# EAGLE design rev1.0.1 (EAGLE 7.2.0)
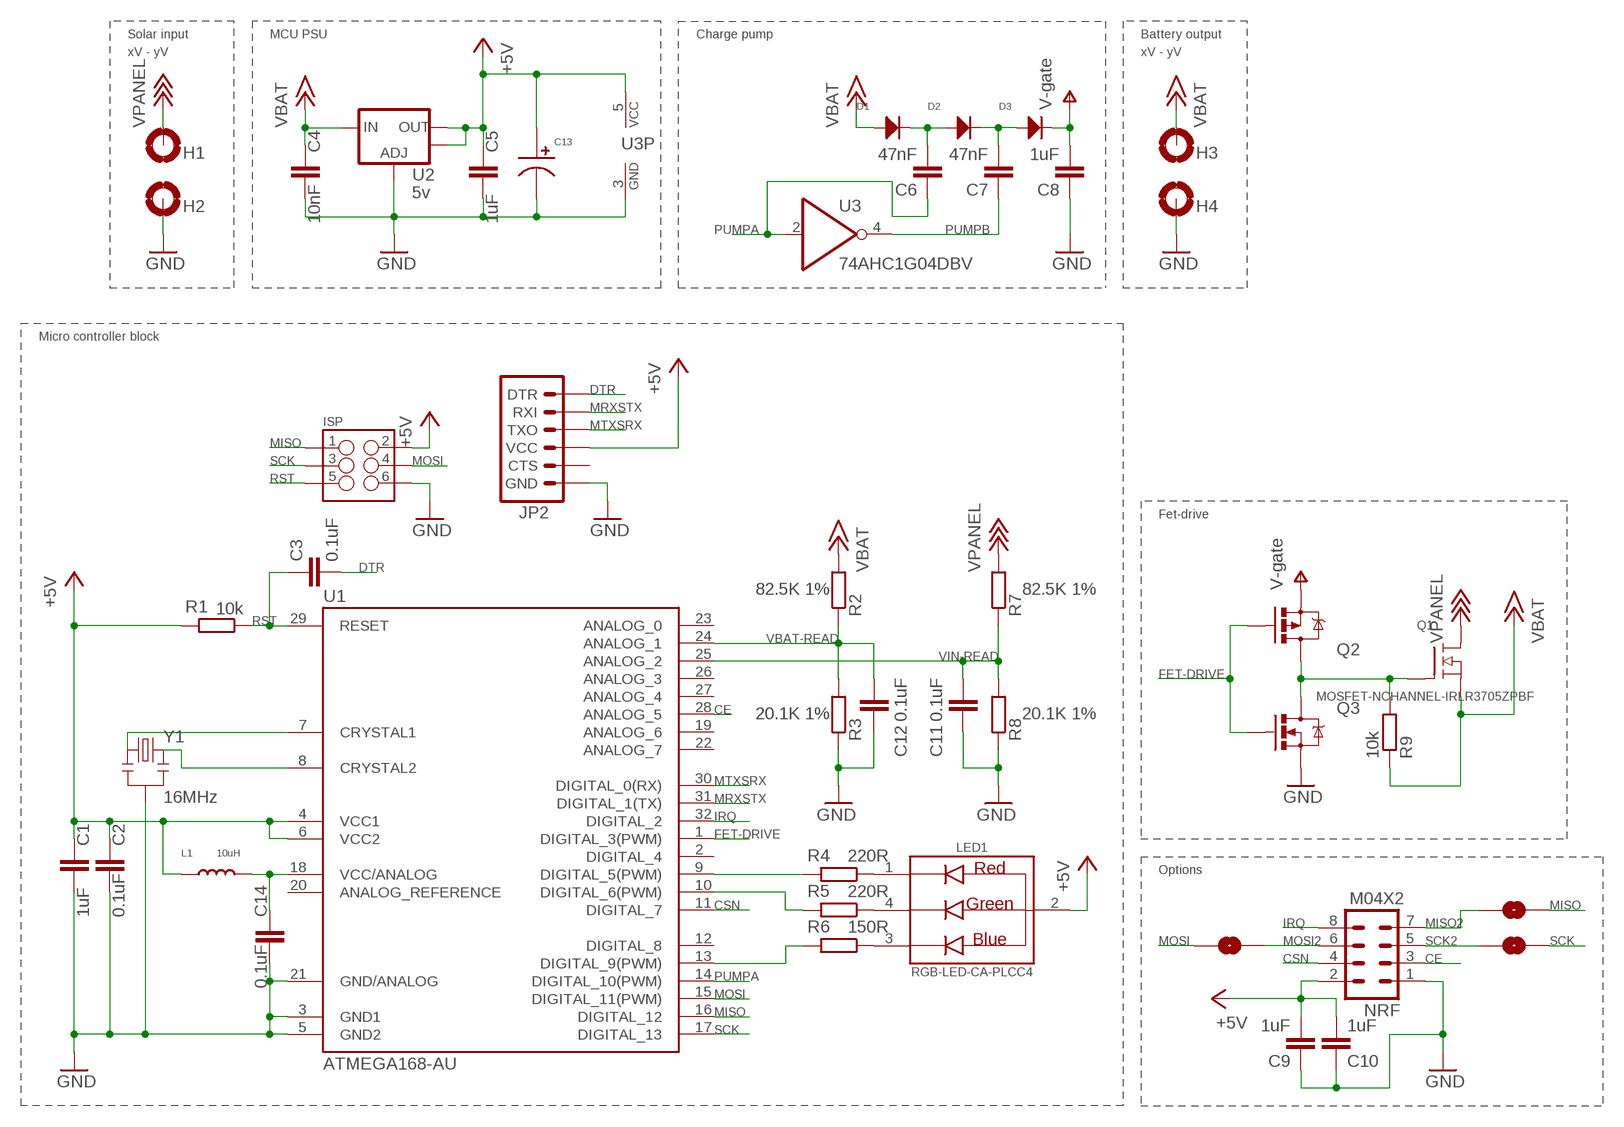
[diagram p0: schematic, sheet 1]

## Parts
C1  1uF  C-EUC0603K  [C0603K]
C2  0.1uF  C-EUC0603K  [C0603K]
C3  0.1uF  C-EUC0603K  [C0603K]
C4  10nF  C-EUC0603K  [C0603K]
C5  1uF  C-EUC0603K  [C0603K]
C6  47nF  C-EUC0603K  [C0603K]
C7  47nF  C-EUC0603K  [C0603K]
C8  1uF  C-EUC0603K  [C0603K]
C9  1uF  C-EUC0603K  [C0603K]
C10  1uF  C-EUC0603K  [C0603K]
C11  0.1uF  C-EUC0603K  [C0603K]
C12  0.1uF  C-EUC0603K  [C0603K]
C13  CAPACITOR_P_4MM  [CP4MM]
C14  0.1uF  C-EUC0603K  [C0603K]
D1  DIODE_SOD-123  [SOD-123]
D2  DIODE_SOD-123  [SOD-123]
D3  DIODE_SOD-123  [SOD-123]
H1  MOUNT-PAD-ROUND3.0  [3,0-PAD]
H2  MOUNT-PAD-ROUND3.0  [3,0-PAD]
H3  MOUNT-PAD-ROUND3.0  [3,0-PAD]
H4  MOUNT-PAD-ROUND3.0  [3,0-PAD]
ISP  M03X22X3_SILK_SM  [2X3]
JP2  ARDUINO_SERIAL_PROGRAMLOCK  [1X06_LOCK]
L1  10uH  INDUCTOR_1210  [L1210]
LED1  RGB-LED-CA-PLCC4  [PLCC4]
NRF  M04X2  [2X4]
Q1  MOSFET-NCHANNEL-IRLR3705ZPBF  [DPAK]
Q2  MOSFET-PCHANNEL  [SOT23]
Q3  MOSFET-NCHANNELBSS138  [SOT23]
R1  10k  R-EU_R0603  [R0603]
R2  82.5K 1%  R-EU_R0603  [R0603]
R3  20.1K 1%  R-EU_R0603  [R0603]
R4  220R  R-EU_R0603  [R0603]
R5  220R  R-EU_R0603  [R0603]
R6  150R  R-EU_R0603  [R0603]
R7  82.5K 1%  R-EU_R0603  [R0603]
R8  20.1K 1%  R-EU_R0603  [R0603]
R9  10k  R-EU_R0603  [R0603]
SJ2  SOLDERJUMPERNO  [SJ_2S-NO]
SJ5  SOLDERJUMPERNO  [SJ_2S-NO]
SJ6  SOLDERJUMPERNO  [SJ_2S-NO]
U1  ATMEGA168-AU  [TQFP32-08]
U2  5v  V_REG_LM1117SOT223  [SOT223]
U3  74AHC1G04DBV  [SOT23-5]
Y1  16MHz  RESONATOR16MHZ  [RESONATOR-SMD]

## Nets
+5V: C1.1 C2.1 C5.1 C9.2 C10.2 C13.P$1 ISP.2 JP2.4(VCC) L1.P$1 LED1.2(CA) NRF.2 R1.2 U1.4(VCC1) U1.6(VCC2) U2.2(OUT) U2.4(OUT) U3.5(VCC)
+15V: C4.1 D1.ANODE H3.B3,0(MOUNT) Q1.2(S) R2.2 R9.1 U2.3(IN) ; supply symbol labelled VBAT
+18V: H1.B3,0(MOUNT) Q1.TAB(D) R7.2 ; supply symbol labelled VPANEL
CE: NRF.3 U1.28(ANALOG_5)
CSN: NRF.4 U1.11(DIGITAL_7)
DTR: C3.2 JP2.1(DTR)
FET-DRIVE: Q2.1(G) Q3.1(G) U1.1(DIGITAL_3(PWM))
FET-PUMP: Q1.1(G) Q2.3(D) Q3.3(D) R9.2
GND: C1.2 C2.2 C4.2 C5.2 C8.1 C9.1 C10.1 C11.1 C12.1 C13.P$2 C14.2 H2.B3,0(MOUNT) H4.B3,0(MOUNT) ISP.6 JP2.6(GND) NRF.1 Q3.2(S) R3.1 R8.1 U1.3(GND1) U1.5(GND2) U1.21(GND/ANALOG) U2.1(ADJ) U3.3(GND) Y1.2
IRQ: NRF.8 U1.32(DIGITAL_2)
MISO: ISP.1 SJ6.2 U1.16(DIGITAL_12)
MISO2: NRF.7 SJ6.1
MOSI: ISP.4 SJ2.1 U1.15(DIGITAL_11(PWM))
MOSI2: NRF.6 SJ2.2
MRXSTX: JP2.2(RXI) U1.31(DIGITAL_1(TX))
MTXSRX: JP2.3(TXO) U1.30(DIGITAL_0(RX))
N$1: U1.8(CRYSTAL2) Y1.3
N$2: U1.7(CRYSTAL1) Y1.1
N$3: R4.2 U1.9(DIGITAL_5(PWM))
N$4: LED1.4(GC) R5.1
N$5: LED1.1(RC) R4.1
N$6: LED1.3(BC) R6.1
N$7: R5.2 U1.10(DIGITAL_6(PWM))
N$8: C7.2 D2.CATHODE D3.ANODE
N$9: R6.2 U1.13(DIGITAL_9(PWM))
N$10: C6.2 D1.CATHODE D2.ANODE
N$14: C14.1 L1.P$2 U1.18(VCC/ANALOG)
PUMPA: C6.1 U1.14(DIGITAL_10(PWM)) U3.2(I)
PUMPB: C7.1 U3.4(O)
RST: C3.1 ISP.5 R1.1 U1.29(RESET)
SCK: ISP.3 SJ5.2 U1.17(DIGITAL_13)
SCK2: NRF.5 SJ5.1
V+: C8.2 D3.CATHODE Q2.2(S) ; supply symbol labelled V-gate
VBAT-READ: C12.2 R2.1 R3.2 U1.24(ANALOG_1)
VIN-READ: C11.2 R7.1 R8.2 U1.25(ANALOG_2)
Unconnected: JP2.5(CTS) U1.2(DIGITAL_4) U1.12(DIGITAL_8) U1.19(ANALOG_6) U1.20(ANALOG_REFERENCE) U1.22(ANALOG_7) U1.23(ANALOG_0) U1.26(ANALOG_3) U1.27(ANALOG_4)

## Notes on the sheet
- Solar input | MCU PSU | Charge pump | Battery output
- xV - yV | xV - yV
- Micro controller block
- Fet-drive
- Options

## Library data of the parts
C1-C12 C14 = resistor:C-EU: CAPACITOR, European symbol
C13 = MF_Passives:CAPACITOR_P: Library: MF_Passives Description: Device for Polarized Capacitors. Manufacture part number (MFG#), Voltage Rating, and Tolerance can be added via Attributes.; MFG#: N/A; TOLERANCE: N/A; VOLTAGE: N/A
D1-D3 = MF_Discrete_Semiconductor:DIODE: Library: MF_Discrete_Semiconductor Description: Device for Single Packaged Diodes. Manufacture part number (MFG#) can be added via Attributes.; MFG#: N/A
H1-H4 = holes:MOUNT-PAD-ROUND: MOUNTING PAD, round
ISP = SparkFun-Connectors:M03X2: 2x3 .1" header. Shrouded, with keying- CONN-10681 SMT- CONN-11415 Pogo pins- HW-11044
JP2 = SparkFun-Connectors:ARDUINO_SERIAL_PROGRAM: FTDI connector footprints
L1 = MF_Passives:INDUCTOR: Library: MF_Passives Description: Device for Inductors. Manufacture part number (MFG#) can be added via Attributes.; MFG#: N/A
LED1 = Custom-parts:RGB-LED-CA-
NRF = SparkFun-Connectors:M04X2: .1" header, two rows of four.
Q1 = Custom-parts:MOSFET-NCHANNEL-
Q2 = SparkFun-DiscreteSemi:MOSFET-PCHANNEL: Generic PMOSFET
Q3 = SparkFun-DiscreteSemi:MOSFET-NCHANNEL: Common NMOSFET Parts MFG P/N Store ID Prod ID FDD8780 TRANS-09984 SI7820DN TRANS-11055 FDS6630A IC-08089 2N7002PW TRANS-11151 FQP30N06L COM-10213 TRANS-10060 BSS123LT1G TRANS-08345 BSS138 TRANS-00830 BS170 2N7000; PROD_ID: TRANS-00830
R1-R9 = resistor:R-EU_: RESISTOR, European symbol
SJ2 SJ5 SJ6 = SparkFun-Passives:SOLDERJUMPER: Solder Jumper Standard SMD solder jumper. Used to automate production. Two varients : Normally Open and Normally Closed are the same, but have different paste layers. NC will have a large amount of paste and should jumper during reflow.
U1 = Arduino-AVR:ATMEGA168
U2 = SparkFun-PowerIC:V_REG_LM1117: Voltage Regulator LM1117 Standard adjustable voltage regulator but in SMD form. Spark Fun Electronics SKU : COM-00595
U3 = 74xx-little-de:74*1G04: INVERTER Gate
Y1 = SparkFun-FreqCtrl:RESONATOR: Resonator Small SMD resonator. Used, eg, on the Arduino Pro/ Pro Mini boards. 8MHz- XTAL-08895 16MHz- XTAL-08900; PROD_ID: XTAL-08900

## Board
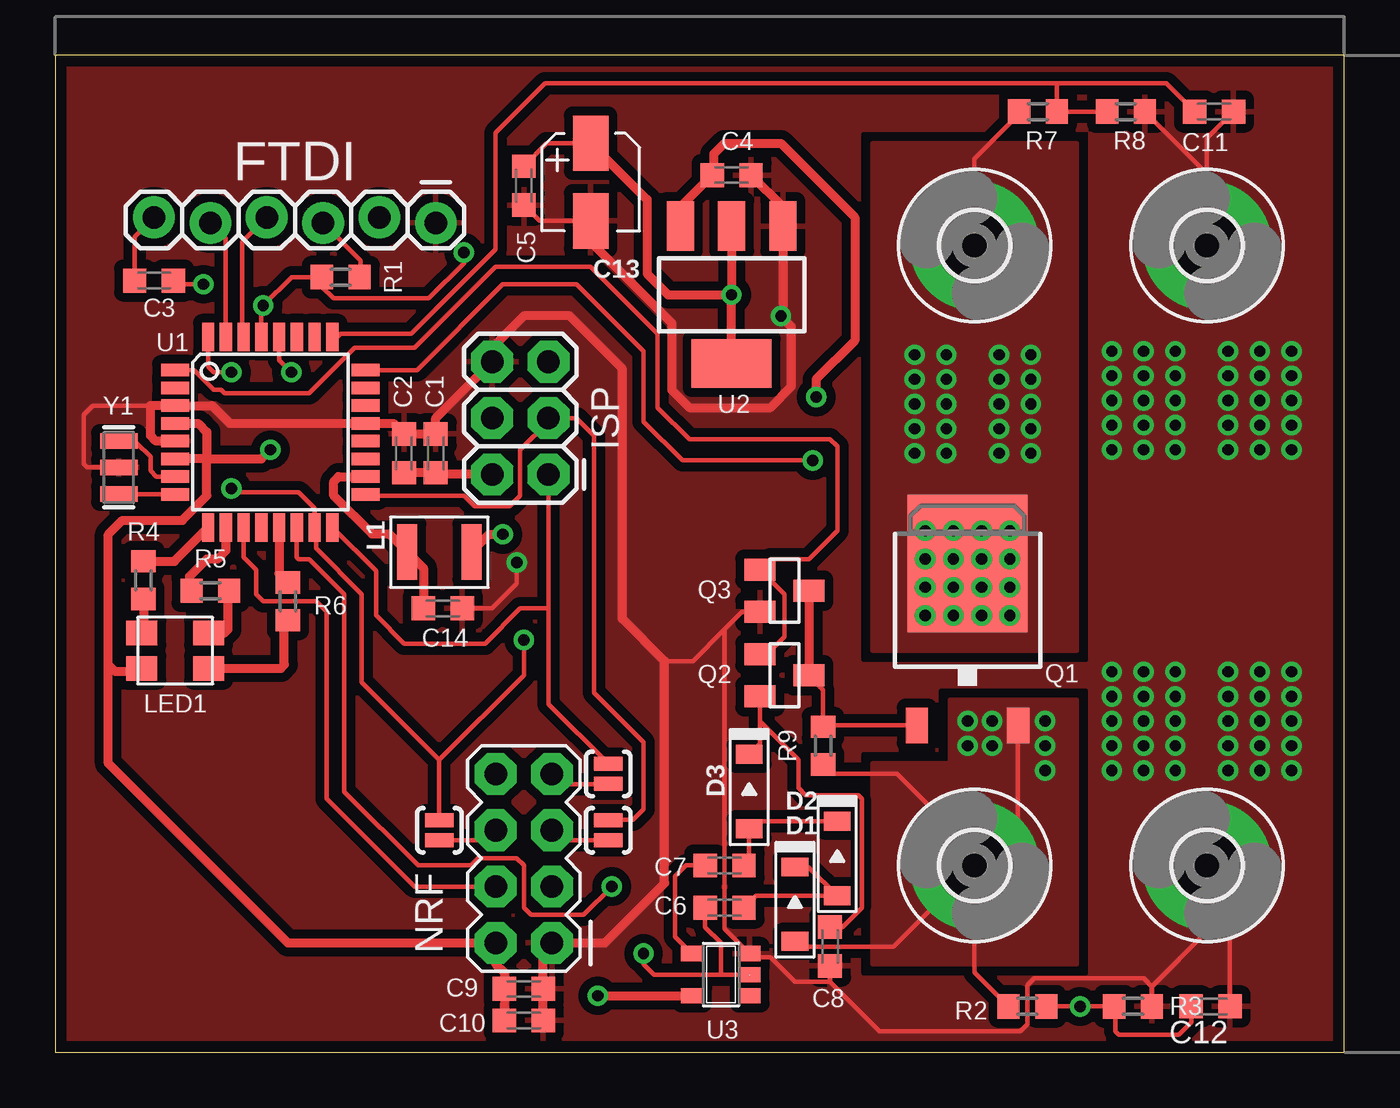
[diagram p1: board, top side]
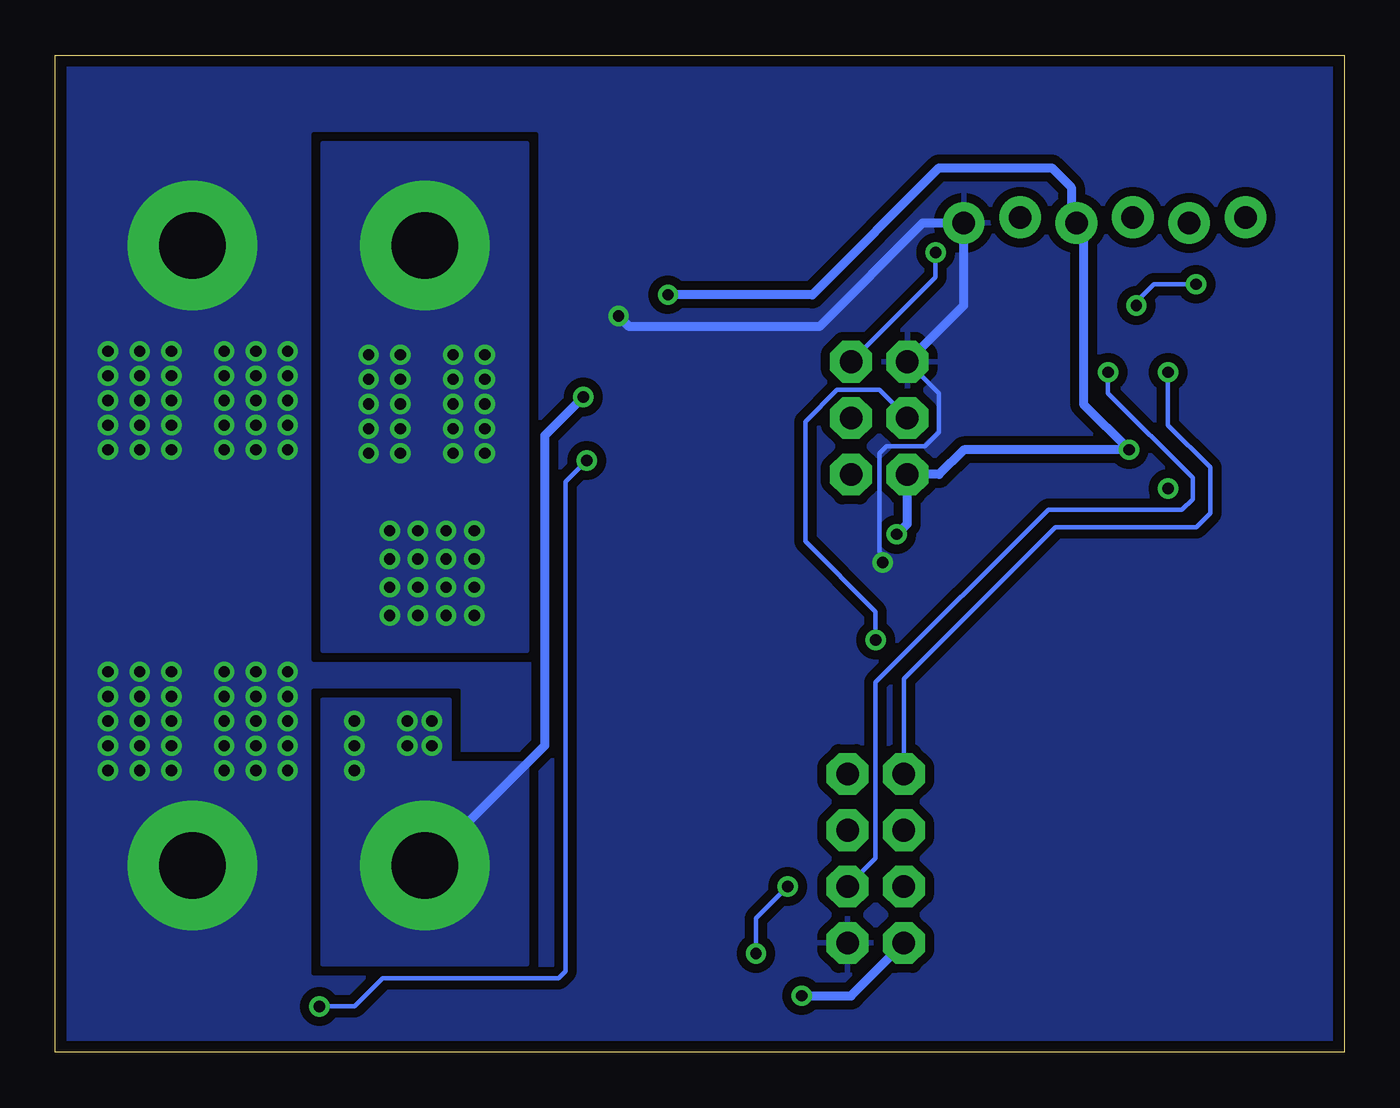
[diagram p2: board, bottom side, seen from below]

Size 58.09 x 44.92 mm. Coordinates in mm from the lower left corner, seen from the top.
Outline: 0,0 58.09,0 58.09,44.92 0,44.92 0,0
Copper layers (1*16): Top 0.035mm / dielectric 1.5mm / Bottom 0.035mm
Design rules "OSH park": minimum track width 6mil, minimum drill 13mil, track to track 6mil, track to pad 6mil, pad to pad 6mil, via to via 6mil, smd to smd 6mil, copper to edge 20mil, drill to drill 16mil, minimum pad ring 10mil, minimum via ring 8mil, stop-mask expansion 4mil, vias tented up to drill 0mil, thermal gap 16mil

### Footprints (pad centres in the part's own frame; a part is rotated, then mirrored left to right if it is on the bottom)
C0603K = smd 1.05 x 1.08: 1 -0.875,0; 2 0.875,0
CP4MM = smd 1.6 x 2.5: P$1 0,-1.75; P$2 0,1.75
SOD-123 = smd 0.85 x 1.2: ANODE 1.675,0; CATHODE -1.675,0
3,0-PAD = drill 3 pad 5.842: B3,0 0,0
2X3 = drill 1.016 pad 1.88 octagon: 1 0,0; 2 0,2.54; 3 2.54,0; 4 2.54,2.54; 5 5.08,0; 6 5.08,2.54
1X06_LOCK = drill 1.016 pad 1.88: 1 0,0; 2 2.54,-0.254; 3 5.08,0; 4 7.62,-0.254; 5 10.16,0; 6 12.7,-0.254
L1210 = smd 0.9 x 2.5: P$1 -1.45,0; P$2 1.45,0
PLCC4 = smd 1.4 x 1.1: 1 -1.5,0.8; 2 -1.5,-0.8; 3 1.5,-0.8; 4 1.5,0.8
2X4 = drill 1.016 pad 1.88 octagon: 1 -3.81,-1.27; 2 -3.81,1.27; 3 -1.27,-1.27; 4 -1.27,1.27; 5 1.27,-1.27; 6 1.27,1.27; 7 3.81,-1.27; 8 3.81,1.27
DPAK = smd 1 x 1.6: 1 -2.28,-6.07; 2 2.28,-6.07 | smd 5.4 x 6.2: TAB 0,1.23
SOT23 = smd 1 x 1.4: 1 -0.95,-1.1; 2 0.95,-1.1; 3 0,1.1
R0603 = smd 1 x 1.1: 1 -0.85,0; 2 0.85,0
SJ_2S-NO = smd 0.635 x 1.27: 1 -0.45,0; 2 0.45,0
TQFP32-08 = smd 1.27 x 0.559: 1 -4.293,2.8; 2 -4.293,2; 3 -4.293,1.2; 4 -4.293,0.4; 5 -4.293,-0.4; 6 -4.293,-1.2; 7 -4.293,-2; 8 -4.293,-2.8; 17 4.293,-2.8; 18 4.293,-2; 19 4.293,-1.2; 20 4.293,-0.4; 21 4.293,0.4; 22 4.293,1.2; 23 4.293,2; 24 4.293,2.8 | smd 0.559 x 1.27: 9 -2.8,-4.293; 10 -2,-4.293; 11 -1.2,-4.293; 12 -0.4,-4.293; 13 0.4,-4.293; 14 1.2,-4.293; 15 2,-4.293; 16 2.8,-4.293; 25 2.8,4.293; 26 2,4.293; 27 1.2,4.293; 28 0.4,4.293; 29 -0.4,4.293; 30 -1.2,4.293; 31 -2,4.293; 32 -2.8,4.293
SOT223 = smd 1.219 x 2.235: 1 -2.311,-3.099; 2 0,-3.099; 3 2.311,-3.099 | smd 3.6 x 2.2: 4 0,3.099
SOT23-5 = smd 0.69 x 0.99: 1 -0.95,-1.29; 2 0,-1.29; 3 0.95,-1.29; 4 0.95,1.3; 5 -0.95,1.3
RESONATOR-SMD = smd 0.7 x 1.7: 1 -1.2,0; 2 0,0; 3 1.2,0

### Placement (x,y rotation side)
C1  17.14,26.99 90 top
C2  15.72,26.99 90 top
C3  4.45,34.77 180 top
C4  30.48,39.53 0 top
C5  21.11,39.05 270 top
C6  30.16,6.51 0 top
C7  30.16,8.41 0 top
C8  34.92,4.76 90 top
C9  21.11,2.86 180 top
C10  21.11,1.43 180 top
C11  52.23,42.39 180 top
C12  52.07,2.06 180 top
C13  24.13,39.21 180 top
C14  17.46,20 0 top
D1  33.34,6.67 270 top
D2  35.24,8.73 270 top
D3  31.27,11.75 270 top
H1  41.43,36.35 270 top
H2  51.91,36.35 270 top
H3  41.43,8.41 90 top
H4  51.91,8.41 90 top
ISP  22.23,26.04 90 top
JP2  4.45,37.62 0 top
L1  17.3,22.54 180 top
LED1  5.4,18.1 0 top
NRF  21.11,8.73 90 top
Q1  41.12,20.8 0 top
Q2  32.86,16.99 270 top
Q3  32.86,20.8 270 top
R1  12.86,34.92 0 top
R2  43.81,2.06 180 top
R3  48.58,2.06 180 top
R4  3.97,21.27 90 top
R5  6.99,20.8 180 top
R6  10.48,20.32 90 top
R7  44.29,42.39 180 top
R8  48.26,42.39 180 top
R9  34.61,13.81 90 top
SJ2  17.3,10 270 top
SJ5  24.92,10 90 top
SJ6  24.92,12.54 90 top
U1  9.68,27.94 0 top
U2  30.48,34.13 180 top
U3  30,3.49 90 top
Y1  2.86,26.35 270 top

### Tracks (layer width: path | path; a pad name or v marks a point on that pad's centre or on a via)
+5V  (via drill 0.51)
  Top 0.203: R1.2 13.76,34.98 13.76,35.67 JP2.4 | C5.1 22.15,40.96 C13.P$1
  Top 0.406: 6.83,26.74 U1.6 | U1.4 6.43,28.34 6.83,27.94 6.83,26.74 | 15.54,25.94 C2.1 C1.1 17.22,26.04 ISP.2 | LED1.2 3.75,17.14 2.7,17.14 2.38,17.46 | 2.38,17.46 2.38,23.34 3.02,23.97 5.71,23.97 6.83,25.08 6.83,26.74 | U2.2 v30.48,34.13 | 2.38,17.46 2.38,13.02 10.48,4.92 NRF.2 19.84,3.97 20.24,3.57 C9.2 C10.2 20.24,2.15 | U3.5 v24.45,2.54 | 30.32,30.87 U2.4 v30.48,34.13 | C13.P$1 26.67,38.42 26.67,35.08 27.62,34.13 v30.48,34.13 | 6.83,26.74 9.28,26.74 v9.68,27.15 | L1.P$1 19.55,23.34 v20.16,23.34
  Bottom 0.406: v24.45,2.54 22.22,2.54 NRF.2 | v30.48,34.13 23.97,34.13 18.26,39.85 13.18,39.85 12.3,38.97 12.3,37.61 JP2.4 11.75,37.05 11.75,29.21 v9.68,27.15 17.14,27.15 18.26,26.04 ISP.2 19.68,23.81 v20.16,23.34
+15V  (via drill 0.51)
  Top 0.203: H3.B3,0 43.4,10.38 Q1.2 | 41.43,4.71 H3.B3,0 | R9.1 35.03,12.54 37.94,12.54 41.43,9.05 H3.B3,0 | H3.B3,0 37.78,4.76 33.73,4.76 33.5,4.99 D1.ANODE | 41.43,4.07 H3.B3,0 | R2.2 41.43,3.6 H3.B3,0
  Top 0.406: U2.3 28.17,38.09 C4.1 29.69,39.61 29.69,40.48 30.16,40.96 32.7,40.96 36.04,37.62 36.04,32.07 34.29,30.32 v34.29,29.53
  Bottom 0.406: v34.29,29.53 36.04,27.78 36.04,13.81 H3.B3,0
  other vias: 41.12,14.92 42.23,14.92 41.12,13.81 42.23,13.81 44.61,14.92 44.61,13.81 44.61,12.7
  pour Top (isolate 0.305, rank 2, no thermals): 36.83,13.02 36.83,3.97 46.04,3.97 46.04,15.88 40.32,15.88 40.32,13.02
  pour Bottom (isolate 0.305, rank 2, no thermals): 36.83,13.02 40.32,13.02 40.32,15.88 46.04,15.88 46.04,3.97 36.83,3.97
+18V  (via drill 0.51)
  Top 0.203: R7.2 43.5,42.33 41.43,40.27 H1.B3,0
  other vias: 39.21,19.68 40.48,19.68 41.75,19.68 43.02,19.68 43.02,20.95 41.75,20.95 40.48,20.95 39.21,20.95 39.21,22.23 40.48,22.23 41.75,22.23 43.02,22.23 43.02,23.5 41.75,23.5 40.48,23.5 39.21,23.5 38.73,31.43 38.73,30.32 38.73,29.21 38.73,28.1 38.73,26.99 40.16,26.99 40.16,28.1 40.16,29.21 40.16,30.32 40.16,31.43 42.55,31.43 43.97,31.43 43.97,30.32 43.97,29.21 43.97,28.1 43.97,26.99 42.55,26.99 42.55,28.1 42.55,29.21 42.55,30.32
  pour Top (isolate 0.305, no thermals): 36.83,18.1 36.83,40.96 46.04,40.96 46.04,18.1
  pour Bottom (isolate 0.381, no thermals): 46.04,18.1 46.04,40.96 36.83,40.96 36.83,18.1
CE  (via drill 0.51)
  Top 0.203: v10.64,30.64 10.08,31.19 U1.28
  Bottom 0.203: NRF.3 21.11,8.73 21.11,16.67 13.34,24.45 7.3,24.45 6.83,24.92 6.83,25.88 10.64,29.69 v10.64,30.64
CSN
  Top 0.203: U1.11 8.48,22.31 9.05,21.75 9.05,20.64 9.37,20.32 11.75,20.32 12.22,19.84 12.22,11.43 16.19,7.46 NRF.4
DTR
  Top 0.203: C3.2 3.57,36.75 JP2.1
FET-DRIVE
  Top 0.203: Q2.1 32.06,17.94 32.86,18.73 32.86,20.65 Q3.1 32.24,22.23 33.97,22.23 35.24,23.5 35.24,27.3 34.92,27.62 28.57,27.62 27.15,29.05 27.15,32.38 24.13,35.4 19.84,35.4 16.19,31.75 13.49,31.75 11.43,29.69 7.62,29.69 7.46,29.84 7.14,29.84 6.25,30.74 U1.1
FET-PUMP
  Top 0.203: Q1.1 34.67,14.73 R9.2 34.61,16.34 Q2.3
  Top 0.406: Q3.3 Q2.3
GND  (via drill 0.51)
  Top 0.203: R8.1 51.91,39.59 H2.B3,0 51.91,41.19 C11.1 | 51.91,5.5 H4.B3,0 | C8.1 34.92,3.17 | 34.92,3.17 37.15,0.95 43.5,0.95 43.81,1.27 43.81,3.02 44.13,3.33 49.05,3.33 49.43,2.96 | 49.43,1.8 R3.1 49.43,2.96 | 34.92,3.17 33.34,3.17 32.23,4.29 31.45,4.29 U3.3 30.16,5.57 30.16,19.05 | Q3.2 30.96,19.85 30.16,19.05 | Y1.2 1.43,26.35 1.27,26.51 1.27,28.73 1.68,29.14 4.29,29.14 | 51.91,5.76 H4.B3,0 | 27.46,17.62 28.73,17.62 30.16,19.05 | 51.91,5.29 H4.B3,0 | 49.43,2.96 51.91,5.44 H4.B3,0 | C12.1 52.95,7.38 H4.B3,0 | C5.2 21.83,37.46 C13.P$2 | C14.2 19.68,20 20.8,21.11 v20.8,22.07
  Top 0.406: U1.5 4.53,27.54 4.29,27.78 4.29,29.14 U1.3 7.05,29.14 7.86,28.34 U1.21 15.24,28.34 C2.2 C1.2 17.14,28.57 ISP.6 19.68,31.75 21.11,33.18 23.18,33.18 25.56,30.8 25.56,19.53 27.46,17.62 27.46,7.62 24.77,4.92 NRF.1 21.99,4.53 C9.1 C10.1 | C4.2 32.79,38.09 U2.1 32.79,33.27 v32.7,33.18 33.18,32.7 33.18,30 32.23,29.05 28.57,29.05 27.78,29.84 27.78,32.86 24.13,36.51 C13.P$2
  Bottom 0.203: v20.8,22.07 20.8,22.38 20.95,22.54 20.95,26.99 20.64,27.3 18.89,27.3 18.26,27.94 18.26,29.69 ISP.6
  Bottom 0.406: ISP.6 17.14,33.66 JP2.6 18.99,37.37 23.65,32.7 32.23,32.7 v32.7,33.18
  other vias: 47.62,31.59 49.05,31.59 50.48,31.59 52.86,31.59 54.29,31.59 55.72,31.59 55.72,30.48 55.72,29.37 55.72,28.26 55.72,27.15 54.29,27.15 52.86,27.15 52.86,28.26 52.86,29.37 52.86,30.48 54.29,30.48 54.29,29.37 54.29,28.26 49.05,27.15 50.48,27.15 47.62,27.15 47.62,28.26 47.62,29.37 47.62,30.48 49.05,30.48 49.05,29.37 49.05,28.26 50.48,28.26 50.48,29.37 50.48,30.48 47.62,12.7 49.05,12.7 50.48,12.7 50.48,13.81 47.62,13.81 49.05,13.81 47.62,14.92 47.62,16.03 47.62,17.14 49.05,17.14 49.05,16.03 49.05,14.92 50.48,14.92 50.48,16.03 50.48,17.14 52.86,17.14 52.86,16.03 52.86,14.92 52.86,13.81 52.86,12.7 54.29,12.7 54.29,16.03 54.29,14.92 54.29,13.81 54.29,17.14 55.72,17.14 55.72,16.03 55.72,14.92 55.72,13.81 55.72,12.7
  pour Bottom (isolate 0.406, rank 3, no thermals): 46.51,40.96 56.67,40.96 56.67,3.97 46.51,3.97
  pour Top (isolate 0.406, rank 3, no thermals): 46.51,40.96 56.67,40.96 56.67,3.97 46.51,3.97
  pour Bottom (isolate 0.406, rank 4): 0,44.93 0,0 58.1,0 58.1,44.93
  pour Top (isolate 0.406, rank 4): 0,44.93 0,0 58.1,0 58.1,44.93
IRQ  (via drill 0.51)
  Top 0.203: v7.94,30.64 7.14,30.64 6.88,30.9 U1.32
  Bottom 0.203: v7.94,30.64 7.94,28.26 6.03,26.35 6.03,24.29 6.67,23.65 13.02,23.65 19.84,16.83 NRF.8
MISO
  Top 0.203: SJ6.2 22.23,15.69 22.23,20 | 22.23,20 ISP.1 | U1.16 14.45,21.68 14.45,19.68 15.72,18.41 19.37,18.41 20.95,20 22.23,20
MISO2
  Top 0.203: SJ6.1 24.9,12.06 22.86,12.06 NRF.7
MOSI  (via drill 0.51)
  Top 0.203: v7.94,25.4 8.1,25.24 10.95,25.24 11.68,24.51 U1.15 11.75,23.58 11.75,22.7 13.81,20.64 13.81,16.67 17.3,13.18 | v21.11,18.57 21.11,16.99 17.3,13.18 | 17.3,13.18 SJ2.1
  Bottom 0.203: v21.11,18.57 21.11,19.84 24.29,23.02 24.29,28.42 22.86,29.84 20.95,29.84 ISP.4
MOSI2
  Top 0.203: SJ2.2 19.39,9.55 NRF.6
MRXSTX
  Top 0.203: U1.31 7.68,36.67 JP2.2
MTXSRX
  Top 0.203: U1.30 8.41,32.3 8.41,36.51 JP2.3
N$1
  Top 0.203: Y1.3 U1.8
N$2
  Top 0.203: Y1.1 2.95,27.46 3.65,27.46 4.29,26.83 4.29,26.19 4.54,25.94 U1.7
N$3
  Top 0.406: R4.2 5.36,22.12 U1.9
N$4
  Top 0.406: LED1.4 7.63,18.9 7.78,19.05 7.78,20.74 R5.1
N$5
  Top 0.406: R4.1 3.97,18.97 LED1.1
N$6
  Top 0.406: LED1.3 10.15,17.3 10.32,17.46 10.32,19.31 R6.1
N$7
  Top 0.406: U1.10 7.68,22.61 7.3,22.23 6.83,22.23 6.03,21.43 6.03,20.9 R5.2
N$8
  Top 0.203: C7.2 31.27,8.65 D3.ANODE 31.61,10.41 D2.CATHODE
N$9
  Top 0.406: U1.13 10.08,21.56 R6.2
N$10
  Top 0.203: D1.CATHODE 33.96,8.34 D2.ANODE 31.59,7.06 C6.2
N$14
  Top 0.406: U1.18 12.76,25.94 12.54,25.72 12.54,25.08 14.27,23.36 15.04,23.36 L1.P$2 16.59,21.81 C14.1
PUMPA  (via drill 0.51)
  Top 0.203: U1.14 10.88,22.3 10.95,22.23 11.43,22.23 13.02,20.64 13.02,11.75 16.35,8.41 18.73,8.41 19.05,8.73 20.8,8.73 21.11,8.41 21.11,6.51 21.43,6.19 23.81,6.19 v25.08,7.46 | 30,3.49 26.99,3.49 26.51,3.97 v26.51,4.45 | 30,3.49 U3.2 | 30,3.49 30,4.92 29.29,5.64 C6.1
  Bottom 0.203: v25.08,7.46 26.51,6.03 v26.51,4.45
PUMPB
  Top 0.203: U3.4 27.94,5.21 27.94,7.94 28.42,8.41 C7.1
RST  (via drill 0.51)
  Top 0.203: C3.1 5.48,34.61 v6.67,34.61 | U1.29 9.28,33.57 v9.37,33.66 10.64,34.92 R1.1 12.01,34.51 12.54,33.97 16.83,33.97 18.41,35.56 v18.41,36.04
  Bottom 0.203: v6.67,34.61 8.57,34.61 9.37,33.81 v9.37,33.66 | ISP.5 18.41,34.92 v18.41,36.04
SCK
  Top 0.203: SJ5.2 24.95,10.48 26.04,10.48 26.51,10.95 26.51,13.97 24.29,16.19 24.29,27.78 23.5,28.57 ISP.3 22.23,28.42 20.95,27.15 20.95,25.08 20.48,24.61 18.89,24.61 18.41,25.08 14.03,25.08 U1.17
SCK2
  Top 0.203: SJ5.1 22.83,9.55 NRF.5
V+
  Top 0.203: 31.76,14.91 33.5,13.18 33.5,11.91 33.81,11.59 36.2,11.59 36.35,11.43 36.35,6.51 35.48,5.64 C8.2 | 31.76,14.91 Q2.2 | D3.CATHODE 31.76,13.91 31.76,14.91
VBAT-READ  (via drill 0.51)
  Top 0.203: R2.1 v46.2,2.06 R3.2 47.78,2.01 47.78,0.95 47.94,0.79 50.64,0.79 51.2,1.35 C12.2 | U1.24 16.29,30.74 20.16,34.61 23.5,34.61 26.51,31.59 26.51,28.42 28.26,26.67 v34.13,26.67
  Bottom 0.203: v46.2,2.06 44.61,2.06 43.34,3.33 35.4,3.33 35.08,3.65 35.08,25.72 v34.13,26.67
VIN-READ
  Top 0.203: R8.2 R7.1 45.14,43.6 45.09,43.66 | U1.25 12.7,32.23 12.86,32.38 16.03,32.38 19.84,36.2 19.84,41.43 22.07,43.66 45.09,43.66 | 45.09,43.66 50.08,43.66 C11.2

### Text on the board
tPlace: FTDI